# EAGLE design spider_mx8_thin (EAGLE 6.5.0)
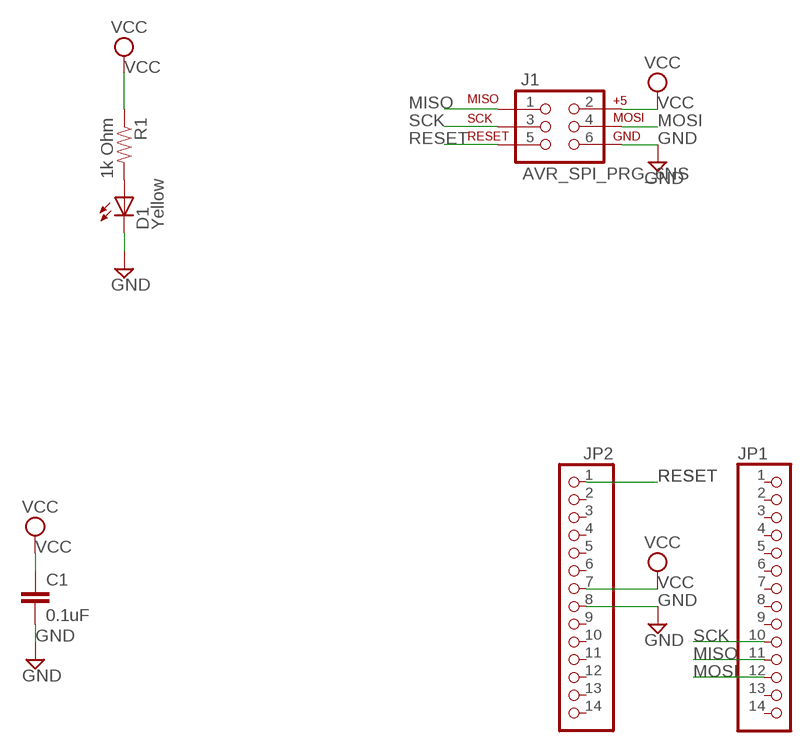
[diagram p0: schematic, sheet 1]

## Parts
C1  0.1uF  CAP1206  [1206]
D1  Yellow  LED-YELLOWLILYPAD  [LED-1206]
J1  AVR_SPI_PRG_6NS  [2X3-NS]
JP1  PINHD-1X14  [1X14]
JP2  PINHD-1X14  [1X14]
R1  1k Ohm  RESISTOR1206  [1206]

## Nets
GND: C1.2 D1.C J1.6 JP2.8
MISO: J1.1 JP1.11
MOSI: J1.4 JP1.12
N$14: D1.A R1.2
RESET: J1.5 JP2.1
SCK: J1.3 JP1.10
VCC: C1.1 J1.2 JP2.7 R1.1
Unconnected: JP1.1 JP1.2 JP1.3 JP1.4 JP1.5 JP1.6 JP1.7 JP1.8 JP1.9 JP1.13 JP1.14 JP2.2 JP2.3 JP2.4 JP2.5 JP2.6 JP2.9 JP2.10 JP2.11 JP2.12 JP2.13 JP2.14

## Library data of the parts
C1 = SparkFun-Passives:CAP: Capacitor Standard 0603 ceramic capacitor, and 0.1" leaded capacitor.
D1 = SparkFun-LED:LED-YELLOW: Yellow SMD LEDs LilyPad 1206- DIO-09909 0603- DIO-09003; PROD_ID: DIO-09909
J1 = SparkFun-Connectors:AVR_SPI_PRG_6: AVR ISP 6 Pin This is the reduced ISP connector for AVR programming. Common on Arduino. This footprint will take up less PCB space and can be used with a 10-pin to 6-pin adapter such as SKU: BOB-08508
JP1 JP2 = pinhead:PINHD-1X14: PIN HEADER
R1 = SparkFun-Passives:RESISTOR: Resistor Basic schematic elements and footprints for 0603, 1206, and PTH resistors.

## Board
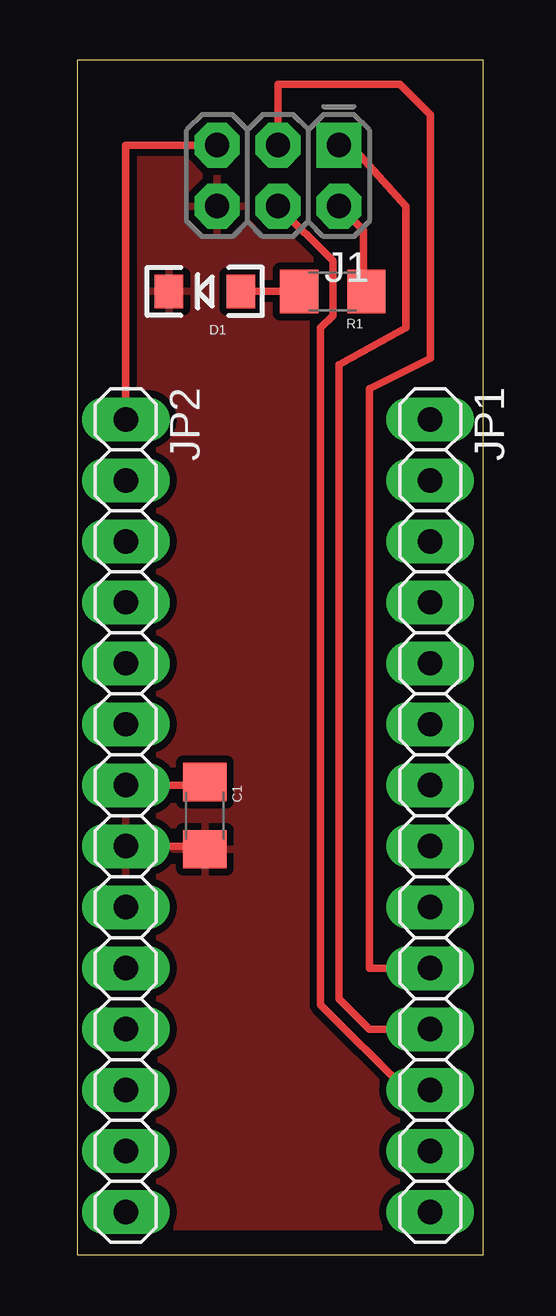
[diagram p1: board, top side]
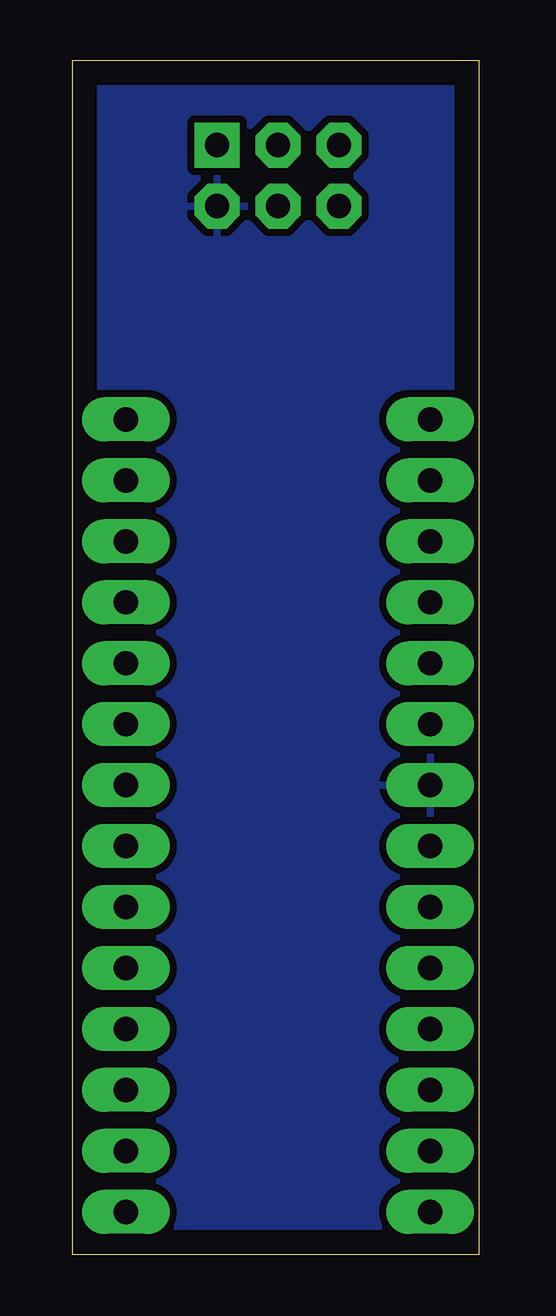
[diagram p2: board, bottom side, seen from below]

Size 16.94 x 49.77 mm. Coordinates in mm from the lower left corner, seen from the top.
Outline: 0,0 16.94,0 16.94,49.77 0,49.77 0,0
Copper layers (1*16): Top 0.035mm / dielectric 1.5mm / Bottom 0.035mm
Design rules "improved_12mil": minimum track width 12mil, minimum drill 0.8mm, track to track 12mil, track to pad 12mil, pad to pad 12mil, via to via 12mil, smd to smd 12mil, copper to edge 40mil, drill to drill 12mil, minimum pad ring 16mil, minimum via ring 16mil, stop-mask expansion 4mil, vias tented up to drill 0mil, thermal gap 12mil

### Footprints (pad centres in the part's own frame; a part is rotated, then mirrored left to right if it is on the bottom)
1206 = smd 1.6 x 1.8: 1 -1.4,0; 2 1.4,0
LED-1206 = smd 1.2 x 1.4: A -1.5,0; C 1.5,0
2X3-NS = drill 1.016 pad 1.88 square: 1 -2.54,-1.27 | drill 1.016 pad 1.88 octagon: 2 -2.54,1.27; 3 0,-1.27; 4 0,1.27; 5 2.54,-1.27; 6 2.54,1.27
1X14 = drill 1.016 long: 1 -16.51,0; 2 -13.97,0; 3 -11.43,0; 4 -8.89,0; 5 -6.35,0; 6 -3.81,0; 7 -1.27,0; 8 1.27,0; 9 3.81,0; 10 6.35,0; 11 8.89,0; 12 11.43,0; 13 13.97,0; 14 16.51,0

### Placement (x,y rotation side)
C1  5.33,18.29 270 top
D1  5.33,40.13 180 top
J1  8.38,44.96 180 top
JP1  14.73,18.29 270 top
JP2  2.03,18.29 270 top
R1  10.67,40.13 180 top

### Tracks (layer width: path | path; a pad name or v marks a point on that pad's centre or on a via)
GND
  Top 0.305: JP2.8 5.33,17.02 C1.2
  pour Top: -0.51,52.58 -0.51,0.51 17.27,0.51 17.27,52.58
MISO
  Top 0.305: JP1.11 12.19,9.4 10.92,10.67 10.92,37.08 13.72,38.61 13.72,43.69 11.43,46.23 J1.1
MOSI
  Top 0.305: JP1.12 13.72,6.86 10.16,10.41 10.16,38.61 10.67,39.12 10.67,41.4 J1.4
N$14
  Top 0.305: 6.6,40.13 D1.A R1.2
RESET
  Top 0.305: J1.5 2.03,46.23 JP2.1
SCK
  Top 0.305: JP1.10 12.19,11.94 12.19,36.07 14.73,37.34 14.73,47.5 13.46,48.77 8.38,48.77 J1.3
VCC
  Top 0.305: JP2.7 5.33,19.56 C1.1 | J1.2 11.94,42.67 11.94,40.13 R1.1
  pour Bottom: -0.51,52.58 -0.51,0.51 17.27,0.51 17.27,52.58